# EAGLE design schematic (EAGLE 9.5.1)
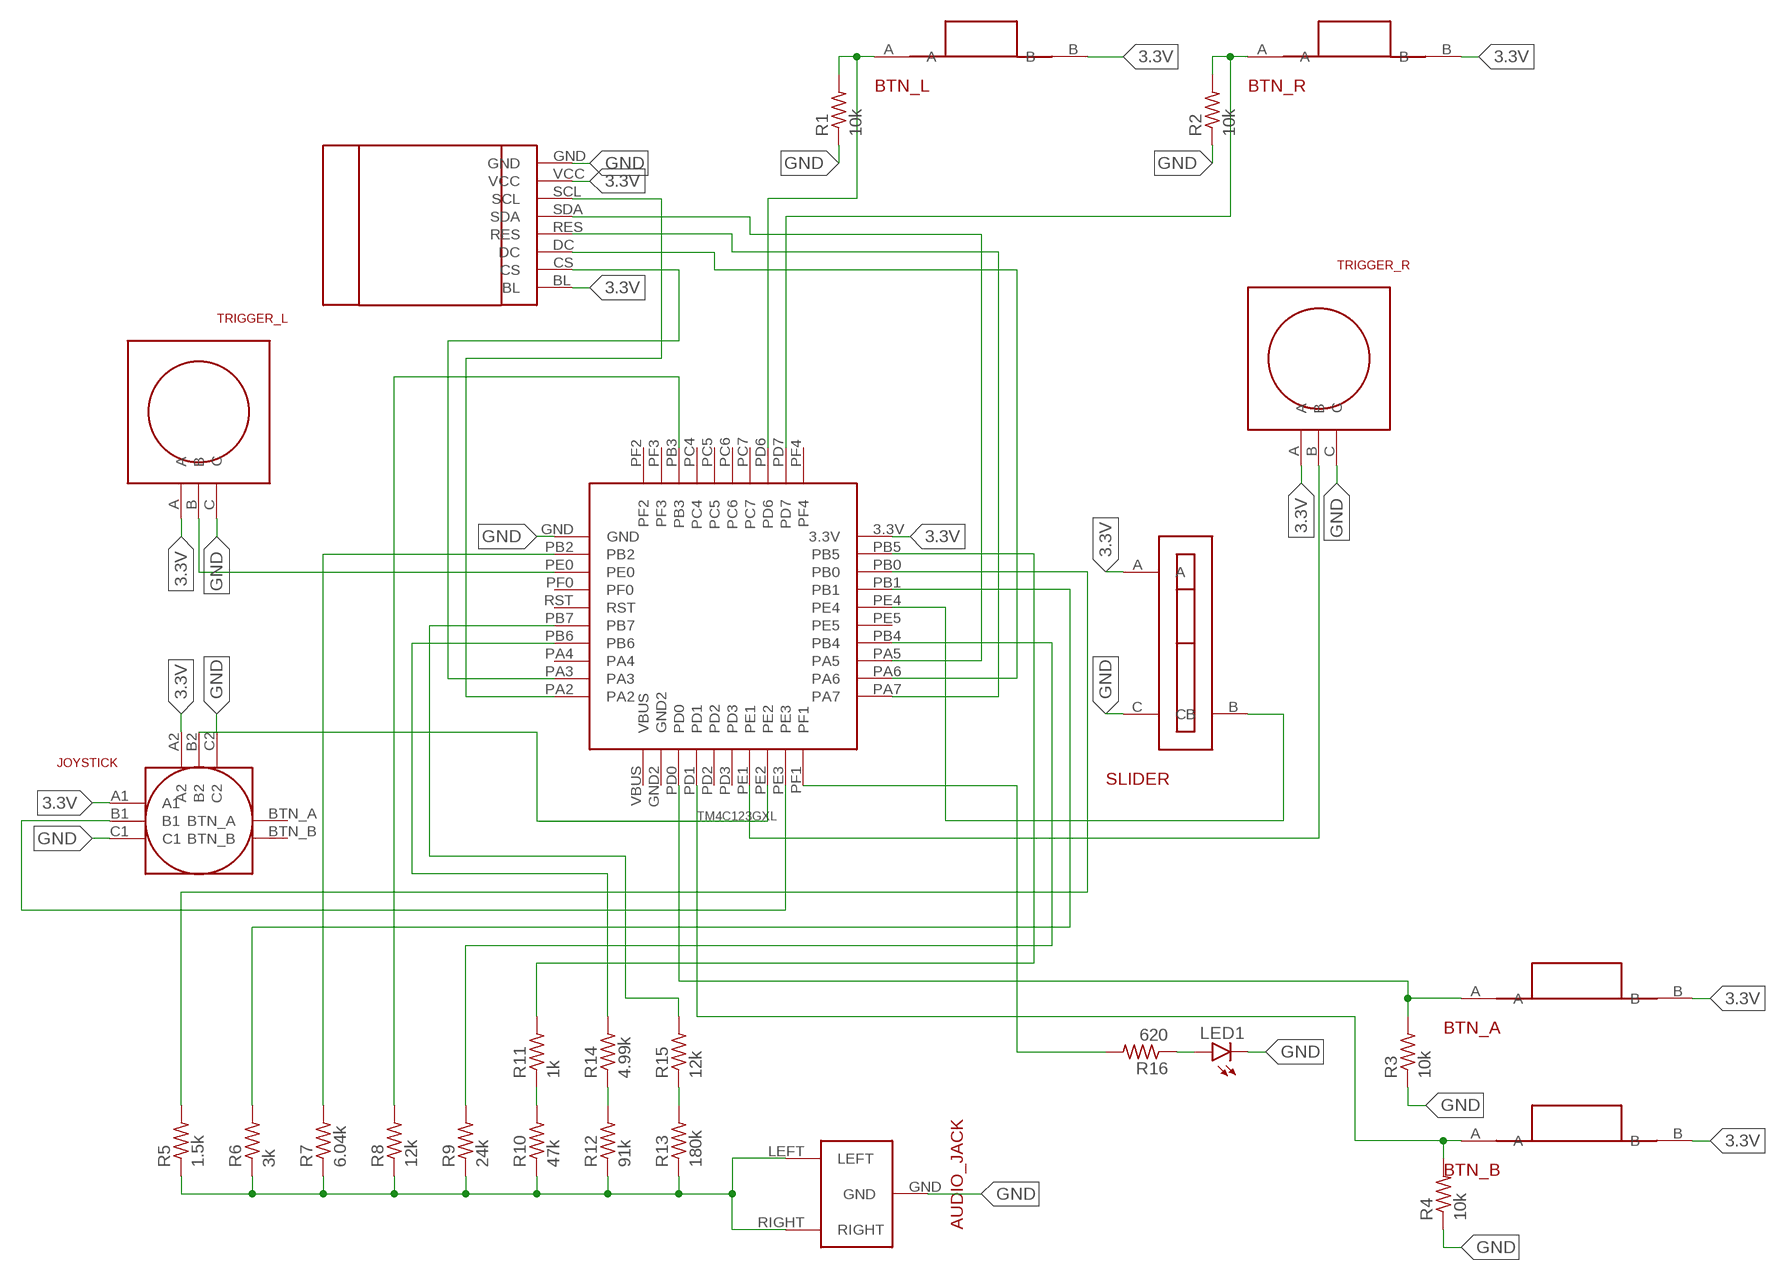
[diagram p0: schematic, sheet 1]

## Parts
LED1  LEDCHIPLED_1206  [CHIPLED_1206]
R1  10k  R-US_R0805  [R0805]
R2  10k  R-US_R0805  [R0805]
R3  10k  R-US_R0805  [R0805]
R4  10k  R-US_R0805  [R0805]
R5  1.5k  R-US_R0805  [R0805]
R6  3k  R-US_R0805  [R0805]
R7  6.04k  R-US_R0805  [R0805]
R8  12k  R-US_R0805  [R0805]
R9  24k  R-US_R0805  [R0805]
R10  47k  R-US_R0805  [R0805]
R11  1k  R-US_R0805  [R0805]
R12  91k  R-US_R0805  [R0805]
R13  180k  R-US_R0805  [R0805]
R14  4.99k  R-US_R0805  [R0805]
R15  12k  R-US_R0805  [R0805]
R16  620  R-US_R0805  [R0805]
U$1  TM4C123GXL  [TM4C123GXL]
U$2  JOYSTICK  [JOYSTICK]
U$3  BTN_L  RIGHT_ANGLE_BUTTON  [RIGHT_ANGLE_BUTTON]
U$4  BTN_R  RIGHT_ANGLE_BUTTON  [RIGHT_ANGLE_BUTTON]
U$5  TRIGGER_L  [TRIGGER_L]
U$6  TRIGGER_R  [TRIGGER_R]
U$7  SLIDER  [SLIDER]
U$8  BTN_A  BUTTON  [BUTTON]
U$9  BTN_B  BUTTON  [BUTTON]
U$10  AUDIO_JACK  [AUDIO_JACK]
U$11  LCD_SCREEN  [LCD_SCREEN]

## Nets
3.3V: U$1.3.3V U$2.A1 U$2.A2 U$3.B U$4.B U$5.A U$6.A U$7.A U$8.B U$9.B U$11.BL U$11.VCC
GND: LED1.C R1.1 R2.1 R3.1 R4.1 U$1.GND U$2.C1 U$2.C2 U$5.C U$6.C U$7.C U$10.GND U$11.GND
N$1: U$1.PE4 U$7.B
N$2: U$1.PE0 U$5.B
N$3: U$1.PE1 U$6.B
N$4: U$1.PE2 U$2.B2
N$6: R16.2 U$1.PF1
N$7: R4.2 U$1.PD1 U$9.A
N$8: R10.2 R11.1
N$9: R2.2 U$1.PD7 U$4.A
N$10: R1.2 U$1.PD6 U$3.A
N$11: R12.2 R14.1
N$12: U$1.PA2 U$11.SCL
N$13: U$1.PA5 U$11.SDA
N$14: U$1.PA7 U$11.RES
N$15: U$1.PA6 U$11.DC
N$16: U$1.PA3 U$11.CS
N$17: R13.2 R15.1
N$18: R5.1 R6.1 R7.1 R8.1 R9.1 R10.1 R12.1 R13.1 U$10.LEFT U$10.RIGHT
N$19: R5.2 U$1.PB0
N$20: R6.2 U$1.PB1
N$21: R7.2 U$1.PB2
N$22: R8.2 U$1.PB3
N$23: R9.2 U$1.PB4
N$24: R11.2 U$1.PB5
N$25: R14.2 U$1.PB6
N$26: R15.2 U$1.PB7
N$27: R3.2 U$1.PD0 U$8.A
N$29: LED1.A R16.1
N$30: U$1.PE3 U$2.B1
Unconnected: U$1.GND2 U$1.PA4 U$1.PC4 U$1.PC5 U$1.PC6 U$1.PC7 U$1.PD2 U$1.PD3 U$1.PE5 U$1.PF0 U$1.PF2 U$1.PF3 U$1.PF4 U$1.RST U$1.VBUS U$2.BTN_A U$2.BTN_B

## Library data of the parts
LED1 = led:LED: LED OSRAM: - CHIPLED LG R971, LG N971, LY N971, LG Q971, LY Q971, LO R971, LY R971 LH N974, LH R974 LS Q976, LO Q976, LY Q976 LO Q996 - Hyper CHIPLED LW Q18S LB Q993, LB Q99A, LB R99A - SideLED LS A670, LO A670, LY A670, LG A670, LP A670 LB A673, LV A673, LT A673, LW A673 LH A674 LY A675 LS A676, LA A676, LO A676, LY A676, LW A676 LS A679, LY A679, LG A679 - Hyper Micro SIDELED® LS Y876, LA Y876, LO Y876, LY Y876 LT Y87S - SmartLED LW L88C, LW L88S LB L89C, LB L89S, LG L890 LS L89K, LO L89K, LY L89K LS L896, LA L896, LO L896, LY L896 - TOPLED LS T670, LO T670, LY T670, LG T670, LP T670 LSG T670, LSP T670, LSY T670, LOP T670, LYG T670 LG T671, LOG T671, LSG T671 LB T673, LV T673, LT T673, LW T673 LH T674 LS T676, LA T676, LO T676, LY T676, LB T676, LH T676, LSB T676, LW T676 LB T67C, LV T67C, LT T67C, LS T67K, LO T67K, LY T67K, LW E67C LS E67B, LA E67B, LO E67B, LY E67B, LB E67C, LV E67C, LT E67C LW T67C LS T679, LY T679, LG T679 LS T770, LO T770, LY T770, LG T770, LP T770 LB T773, LV T773, LT T773, LW T773 LH T774 LS E675, LA E675, LY E675, LS T675 LS T776, LA T776, LO T776, LY T776, LB T776 LHGB T686 LT T68C, LB T68C - Hyper Mini TOPLED® LB M676 - Mini TOPLED Santana® LG M470 LS M47K, LO M47K, LY M47K Source: http://www.osram.convergy.de LUXEON: - LUMILED® LXK2-PW12-R00, LXK2-PW12-S00, LXK2-PW14-U00, LXK2-PW14-V00 LXK2-PM12-R00, LXK2-PM12-S00, LXK2-PM14-U00 LXK2-PE12-Q00, LXK2-PE12-R00, LXK2-PE12-S00, LXK2-PE14-T00, LXK2-PE14-U00 LXK2-PB12-K00, LXK2-PB12-L00, LXK2-PB12-M00, LXK2-PB14-N00, LXK2-PB14-P00, LXK2-PB14-Q00 LXK2-PR12-L00, LXK2-PR12-M00, LXK2-PR14-Q00, LXK2-PR14-R00 LXK2-PD12-Q00, LXK2-PD12-R00, LXK2-PD12-S00 LXK2-PH12-R00, LXK2-PH12-S00 LXK2-PL12-P00, LXK2-PL12-Q00, LXK2-PL12-R00 Source: www.luxeon.com KINGBRIGHT: KA-3528ASYC Source: www.kingbright.com
R1-R16 = rcl:R-US_: RESISTOR, American symbol; SPICEPREFIX: R
U$1 = 319H Final Project:TM4C123GXL
U$2 = 319H Final Project:JOYSTICK
U$3 U$4 = 319H Final Project:RIGHT_ANGLE_BUTTON
U$5 = 319H Final Project:TRIGGER_L
U$6 = 319H Final Project:TRIGGER_R
U$7 = 319H Final Project:SLIDER
U$8 U$9 = 319H Final Project:BUTTON
U$10 = 319H Final Project:AUDIO_JACK
U$11 = 319H Final Project:LCD_SCREEN

## Board
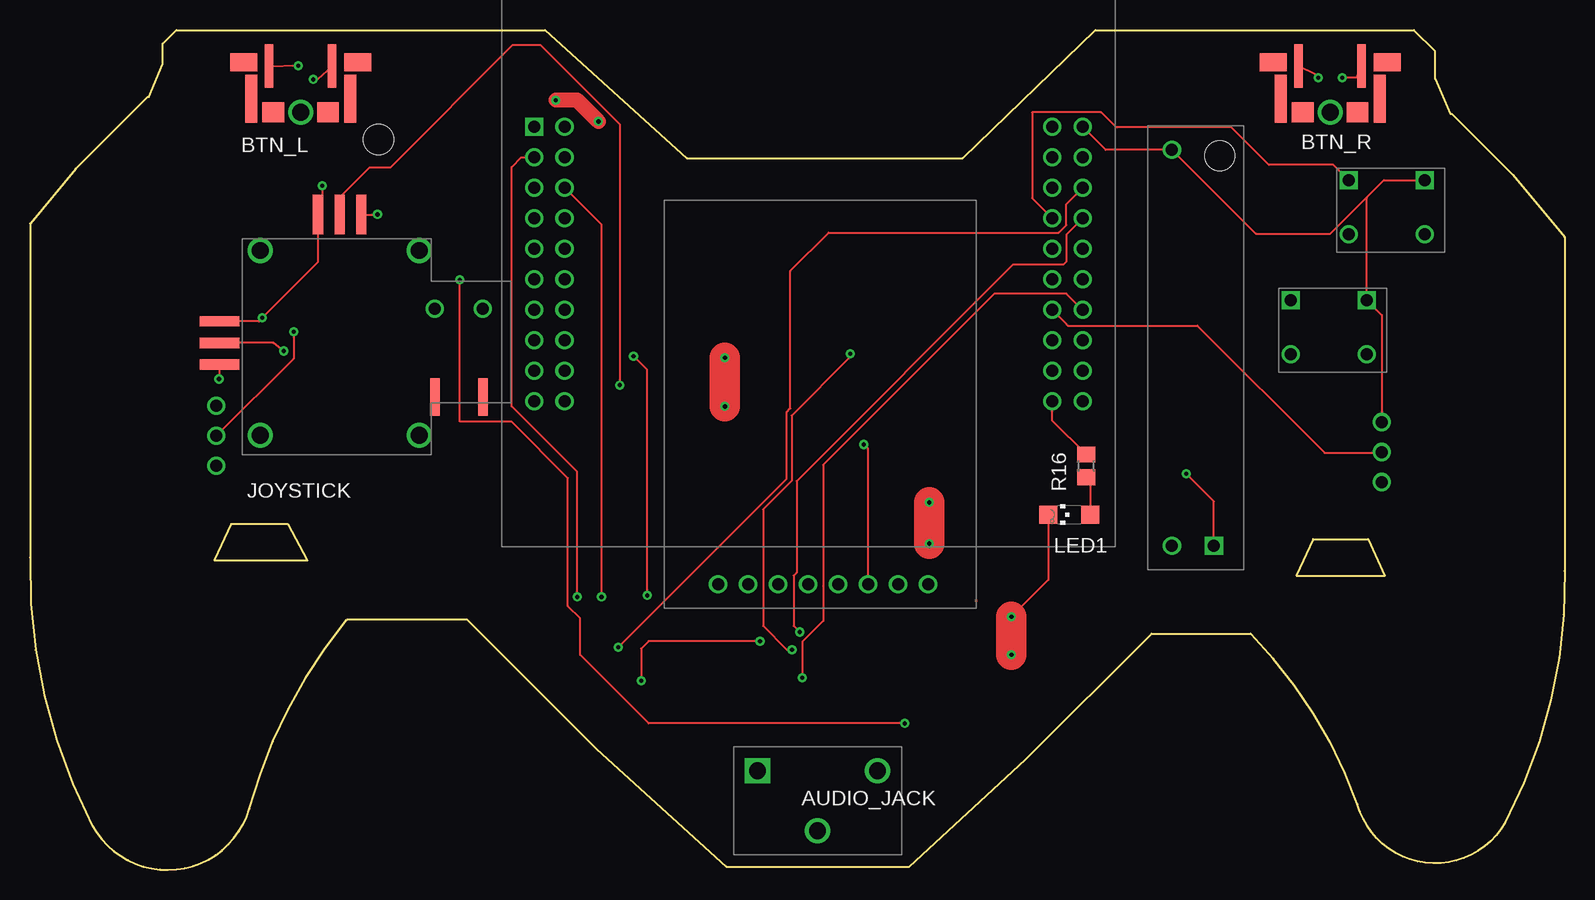
[diagram p1: board, top side]
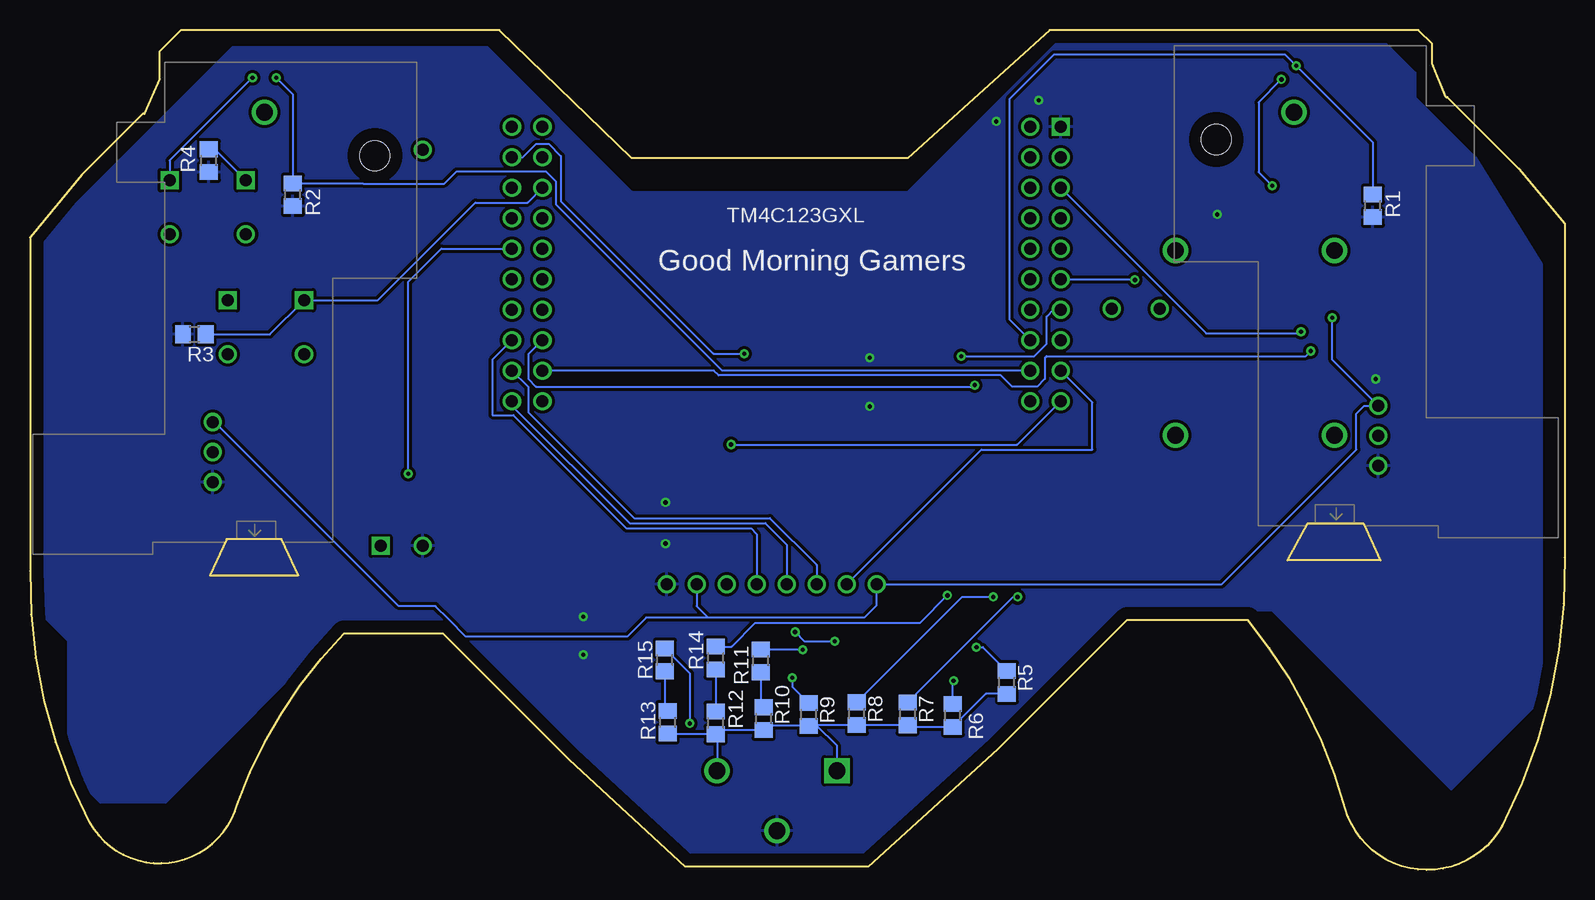
[diagram p2: board, bottom side, seen from below]

Size 127.89 x 70 mm. Coordinates in mm from the lower left corner, seen from the top.
Outline: 117.09,68.22 115.32,70 88.77,70 77.72,59.33 54.74,59.33 42.93,70 12.19,70 11.05,68.85 11.05,67.2 9.91,64.41 9.78,64.41 3.81,58.44 0,53.87 0,26.06 arc29 5.21,3.7 arc135 18.29,5.1 arc-24 26.42,20.85 36.45,20.85 47.24,10.05 58.04,0.27 73.28,0.27 82.93,9.16 93.47,19.71 101.73,19.71 arc-24 110.62,5.48 arc135 122.94,3.96 arc29 127.89,24.91 127.89,52.73 123.57,57.93 118.49,63.01 118.36,63.01 117.09,65.93 117.09,68.22
Copper layers (1*16): Top 0.035mm / dielectric 1.5mm / Bottom 0.035mm
Design rules "default *": minimum track width 6mil, minimum drill 0.35mm, track to track 10mil, track to pad 10mil, pad to pad 10mil, via to via 10mil, smd to smd 10mil, copper to edge 40mil, drill to drill 6mil, minimum pad ring 10mil, minimum via ring 8mil, stop-mask expansion 4mil, vias tented up to drill 0mil, thermal gap 10mil
Milling: 8 lines

### Footprints (pad centres in the part's own frame; a part is rotated, then mirrored left to right if it is on the bottom)
CHIPLED_1206 = smd 1.5 x 1.5: A 0,-1.75; C 0,1.75
R0805 = smd 1.3 x 1.5: 1 -0.95,0; 2 0.95,0
TM4C123GXL = drill 1: 3.3V 21.59,0; GND2 19.05,-2.54; PA2 -24.13,-22.86; PA3 -24.13,-20.32; PA4 -24.13,-17.78; PA5 21.59,-17.78; PA6 21.59,-20.32; PA7 21.59,-22.86; PB0 21.59,-5.08; PB1 21.59,-7.62; PB2 -24.13,-2.54; PB3 -21.59,-5.08; PB4 21.59,-15.24; PB5 21.59,-2.54; PB6 -24.13,-15.24; PB7 -24.13,-12.7; PC4 -21.59,-7.62; PC5 -21.59,-10.16; PC6 -21.59,-12.7; PC7 -21.59,-15.24; PD0 19.05,-5.08; PD1 19.05,-7.62; PD2 19.05,-10.16; PD3 19.05,-12.7; PD6 -21.59,-17.78; PD7 -21.59,-20.32; PE0 -24.13,-5.08; PE1 19.05,-15.24; PE2 19.05,-17.78; PE3 19.05,-20.32; PE4 21.59,-10.16; PE5 21.59,-12.7; PF0 -24.13,-7.62; PF1 19.05,-22.86; PF2 -21.59,0; PF3 -21.59,-2.54; PF4 -21.59,-22.86; RST -24.13,-10.16; VBUS 19.05,0 | drill 1 square: GND -24.13,0
JOYSTICK = smd 3.3 x 0.86: A1 -10.3,1.72; B1 -10.3,-0.08; C1 -10.3,-1.88 | smd 0.86 x 3.3: A2 -2.075,10.62; B2 -0.275,10.62; C2 1.525,10.62 | smd 0.8 x 3.1: BTN_A 7.65,-4.58; BTN_B 11.65,-4.58 | drill 1.4: P$1 6.35,7.62; P$2 -6.9,7.62; P$3 6.35,-7.78; P$4 -6.9,-7.78 | drill 1: P$11 7.65,2.77; P$12 11.65,2.77
RIGHT_ANGLE_BUTTON = smd 0.72 x 3.6: A -2.81,0.97; B 2.43,0.97 | smd 2.25 x 1.5: P$1 -4.935,1.27; P$6 4.555,1.27 | smd 1.8 x 1.7: P$2 2.101,-2.88; P$5 -2.471,-2.88 | smd 1 x 4: P$4 -4.31,-1.738; P$7 3.93,-1.738 | drill 1.4: P$8 -0.185,-2.88
TRIGGER_L = drill 1: A 1.27,-7.7; B 1.27,-10.2; C 1.27,-12.7 | hole 2.5: -12.23,14.5
TRIGGER_R = drill 1: A -3.81,-7.7; B -3.81,-10.2; C -3.81,-12.7 | hole 2.5: 9.69,14.5
SLIDER = drill 1: A -2.54,8.89; C -2.54,-24.11 | drill 1 square: B 0.96,-24.11
BUTTON = drill 1 square: A -3.81,2.54; B 2.54,2.54 | drill 1: P$3 -3.81,-1.96; P$4 2.54,-1.96
AUDIO_JACK = drill 1.4: GND 0,-2.54; LEFT 5,2.46 | drill 1.4 square: RIGHT -5,2.46
LCD_SCREEN = drill 1: BL 8.61,3.81; CS 6.11,3.81; DC 3.61,3.81; GND -8.89,3.81; RES 1.11,3.81; SCL -3.89,3.81; SDA -1.39,3.81; VCC -6.39,3.81

### Placement (x,y rotation side)
LED1  86.61,29.61 90 top
R1  15.98,55.35 90 bottom
R2  105.98,56.27 90 bottom
R3  114.19,44.64 0 bottom
R4  112.98,59.11 90 bottom
R5  46.49,15.63 90 bottom
R6  50.98,12.87 90 bottom
R7  54.74,13.01 90 bottom
R8  58.98,13.03 90 bottom
R9  62.98,12.95 90 bottom
R10  66.74,12.61 90 bottom
R11  66.98,17.43 90 bottom
R12  70.74,12.26 90 bottom
R13  74.74,12.31 90 bottom
R14  70.74,17.66 90 bottom
R15  74.98,17.51 90 bottom
R16  88.01,33.68 90 top
U$1  66.13,61.93 0 top
U$2  26.08,44 0 top
U$3  22.74,66.02 0 top
U$4  108.53,66.02 0 top
U$5  16.8,46.37 0 bottom
U$6  108.84,45.03 0 bottom
U$7  97.7,51.12 0 top
U$8  108.86,44.94 0 top
U$9  113.7,54.94 0 top
U$10  65.63,5.81 0 top
U$11  65.94,27.61 180 top

### Tracks (layer width: path | path; a pad name or v marks a point on that pad's centre or on a via)
3.3V  (via drill 0.35)
  Top 0.152: U$4.B 110.53,66.02 v109.35,66.02 | U$1.3.3V 89.64,60.01 U$7.A 102.15,53.02 108.36,53.02 111.36,56.02 | U$9.B 112.82,57.48 111.36,56.02 | 111.36,56.02 111.4,55.98 U$8.B 112.65,46.23 U$6.A | U$2.A1 19.06,45.72 v19.36,46.02 24.01,50.67 U$2.A2 24.36,54.98 v24.36,57.02 | U$3.B 23.98,65.88 v23.6,65.88
  Bottom 0.152: v109.35,66.02 116.24,59.12 U$9.B | U$11.VCC 72.33,21.99 71.36,21.02 | 71.36,21.02 58.36,21.02 57.33,22.05 U$11.BL 28.58,23.8 17.36,35.02 17.36,38.02 16.71,38.67 U$5.A 19.36,42.5 v19.36,46.02 | v23.6,65.88 25.51,63.97 25.51,58.16 v24.36,57.02 | U$6.A 112.49,37.33 97.15,21.99 94.11,21.99 92.99,20.87 91.57,19.45 78.11,19.45 76.54,21.02 71.36,21.02
GND  (via drill 0.35)
  Top 0.152: U$2.C2 v28.95,54.62 v28.96,54.63 | U$2.C1 15.78,40.95 v15.75,40.91 | LED1.C 84.86,24.18 v81.79,21.1
  Top 1.27: v47.37,62.38 45.59,64.16 v43.81,64.16
  Top 2.54: v57.91,38.63 v57.91,42.69 | v74.93,27.2 v74.93,30.63 | v81.79,17.93 v81.79,21.1
  pour Bottom: 1.91,50.5 1.91,14.24 9.46,6.69 24.38,21.61 37.34,21.61 58.42,0.53 73.03,0.53 93.22,20.72 101.47,20.72 116.59,5.61 122.05,5.61 124.71,8.28 124.71,19.07 126.75,21.1 126.75,52.85 111,68.6 89.79,68.6 77.72,56.54 54.74,56.54 42.29,68.98 14.99,68.98 12.45,66.44 12.45,64.41 7.4,59.36
N$1  (via drill 0.35)
  Top 0.152: U$7.B 98.66,30.72 v96.36,33.02
  Bottom 0.152: v96.36,33.02 96.36,49.02 93.61,51.77 U$1.PE4
N$2  (via drill 0.35)
  Top 0.152: v21.97,44.85 21.97,42.61 U$5.B
  Bottom 0.152: U$1.PE0 29.88,44.72 22.1,44.72 v21.97,44.85
N$3
  Top 0.152: U$6.B 112.58,34.76 107.88,34.76 97.28,45.36 86.49,45.36 86.36,45.49 86.36,45.51 U$1.PE1
N$4  (via drill 0.35)
  Top 0.152: U$2.B2 25.81,56.06 28.28,58.53 30,58.53 40.23,68.76 42.52,68.76 49.15,62.12 v49.15,40.41
  Bottom 0.152: U$1.PE2 86.36,42.97 86.36,40.91 85.73,40.28 49.28,40.28 v49.15,40.41
N$6
  Top 0.152: R16.2 85.18,37.45 U$1.PF1
N$7
  Top 0.152: U$9.A 108.62,58.75 103.25,58.75 100.12,61.87 90.51,61.87 89.25,63.13 83.51,63.13 83.51,55.99 U$1.PD1
  Bottom 0.152: R4.2 112.47,60.06 U$9.A
N$8
  Bottom 0.152: R11.1 66.98,13.8 R10.2
N$9  (via drill 0.35)
  Top 0.152: v107.36,66.02 107.18,66.27 U$4.A
  Bottom 0.152: v107.36,66.02 105.98,64.64 R2.2 100.16,57.22 100.12,57.19 93.36,57.19 92.35,58.2 84.89,58.2 84.07,57.38 84.07,55.48 70.25,41.65 44.58,41.65 U$1.PD7
N$10  (via drill 0.35)
  Top 0.152: U$3.A 22.32,67.07 v22.36,67.02
  Bottom 0.152: R1.2 15.98,60.64 v22.36,67.02 23.31,67.97 42.55,67.97 46.23,64.28 46.23,45.83 U$1.PD6
N$11
  Bottom 0.152: R14.1 R12.2
N$12  (via drill 0.35)
  Top 0.152: U$11.SCL 69.83,35.09 v69.47,35.45
  Bottom 0.152: v69.47,35.45 45.62,35.45 U$1.PA2
N$13
  Bottom 0.152: U$1.PA5 89.36,42.51 89.36,37.89 87.61,37.89 78.18,28.46 67.81,28.46 67.33,27.99 U$11.SDA
N$14
  Bottom 0.152: U$1.PA7 87.72,38.69 77.93,28.89 66.62,28.89 64.83,27.11 U$11.RES
N$15
  Bottom 0.152: U$1.PA6 86.36,40.25 86.36,38.14 77.55,29.33 66.24,29.33 62.33,25.42 U$11.DC
N$16
  Bottom 0.152: U$11.CS 48.61,35.02 39.36,35.02 39.36,38.97 U$1.PA3
N$17
  Bottom 0.152: R15.1 74.98,13.5 R13.2
N$18
  Bottom 0.152: 62.36,12.08 R8.1 58.96,12.06 R7.1 54.6,11.92 R6.1 48.23,14.68 R5.1 | 62.36,12.08 62.9,12.08 R9.1 66.4,12 R10.1 70.39,11.66 R12.1 | R12.1 74.69,11.31 R13.1 | U$10.RIGHT 60.63,10.35 62.36,12.08 | R12.1 70.63,11.2 U$10.LEFT
N$19  (via drill 0.35)
  Top 0.152: v49.02,18.56 63.06,32.6 63.06,38.15 63.37,38.46 63.37,49.93 66.55,53.11 85.73,53.11 86.36,53.74 86.36,55.49 U$1.PB0
  Bottom 0.152: v49.02,18.56 48.47,18.56 R5.2
N$20  (via drill 0.35)
  Top 0.152: U$1.PB1 86.36,52.95 86.36,50.69 86.11,50.44 81.92,50.44 63.88,32.41 63.88,24.79 63.63,24.53 63.63,20.34 v64.14,19.83 | v60.83,19.07 51.56,19.07 50.93,18.44 v50.93,15.77
  Bottom 0.152: v64.14,19.83 63.37,19.07 v60.83,19.07 | R6.2 50.98,15.71 v50.93,15.77
N$21  (via drill 0.35)
  Top 0.152: v45.59,22.75 45.59,33.17 40.13,38.63 40.13,58.57 40.95,59.39 U$1.PB2
  Bottom 0.152: R7.2 45.95,22.75 v45.59,22.75
N$22  (via drill 0.35)
  Top 0.152: v47.62,22.75 47.62,53.77 U$1.PB3
  Bottom 0.152: R8.2 50.21,22.75 v47.62,22.75
N$23  (via drill 0.35)
  Top 0.152: U$1.PB4 87.69,46.69 86.36,48.02 80.36,48.02 66.1,33.75 66.1,23.65 66.11,23.63 66.11,20.77 64.36,19.02 v64.36,16.02
  Bottom 0.152: v64.36,16.02 64.36,15.28 R9.2
N$24  (via drill 0.35)
  Top 0.152: v68.36,43.02 68.36,42.77 63.47,37.87 63.47,32.43 61.09,30.05 61.09,20.34 63.06,18.36 v63.5,18.36
  Bottom 0.152: U$1.PB5 86.83,59.39 85.72,60.5 84.65,60.5 83.64,59.49 83.64,55.73 70.93,43.02 v68.36,43.02 | R11.2 63.75,18.38 63.52,18.38 v63.5,18.36
N$25  (via drill 0.35)
  Top 0.152: v51.44,22.88 51.44,41.68 v50.29,42.82
  Bottom 0.152: R14.2 69.42,18.61 67.44,20.59 53.72,20.59 v51.44,22.88 | v50.29,42.82 44.2,42.82 43.18,43.84 43.18,46.12 42.61,46.69 U$1.PB6
N$26  (via drill 0.35)
  Top 0.152: v72.9,12.21 51.56,12.21 45.85,17.93 45.85,20.98 44.83,21.99 44.83,32.66 40.13,37.36 35.81,37.36 v35.81,49.17
  Bottom 0.152: R15.2 72.9,16.37 v72.9,12.21 | v35.81,49.17 41.94,49.17 U$1.PB7
N$27
  Bottom 0.152: R3.2 107.89,44.64 U$8.A 98.9,47.48 90.78,55.61 86.43,55.61 U$1.PD0
N$28
  Top 0.152: 78.87,22.37 78.87,22.5
N$29
  Top 0.152: R16.1 88.36,32.37 LED1.A
N$30  (via drill 0.35)
  Top 0.152: v21.15,43.24 20.26,43.92 20.22,43.96 15.83,43.96 U$2.B1
  Bottom 0.152: U$1.PE3 70.89,41.61 70.5,41.22 46.99,41.22 46.05,40.28 43.94,40.28 43.31,40.91 43.31,42.69 43.18,42.82 21.58,42.82 v21.15,43.24

### Text on the board
bPlace: Good Morning Gamers